# Altium schematic sheet FAA.SchDoc
size A4
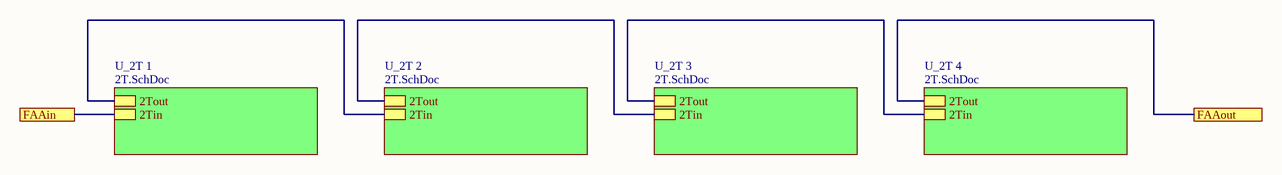
[diagram p0: FAA.SchDoc]

## Sub-sheets
U_2T 1 = 2T.SchDoc: 2Tout, 2Tin
U_2T 2 = 2T.SchDoc: 2Tout, 2Tin
U_2T 3 = 2T.SchDoc: 2Tout, 2Tin
U_2T 4 = 2T.SchDoc: 2Tout, 2Tin

## Ports
FAAin, FAAout

## Nets
FAAin: port FAAin, sheet U_2T 1/2Tin
FAAout: port FAAout, sheet U_2T 4/2Tout
(unnamed): sheet U_2T 1/2Tout, sheet U_2T 2/2Tin
(unnamed): sheet U_2T 2/2Tout, sheet U_2T 3/2Tin
(unnamed): sheet U_2T 3/2Tout, sheet U_2T 4/2Tin